# Altium schematic sheet main.SchDoc
size A; SheetNumber: 2; SheetTotal: 2
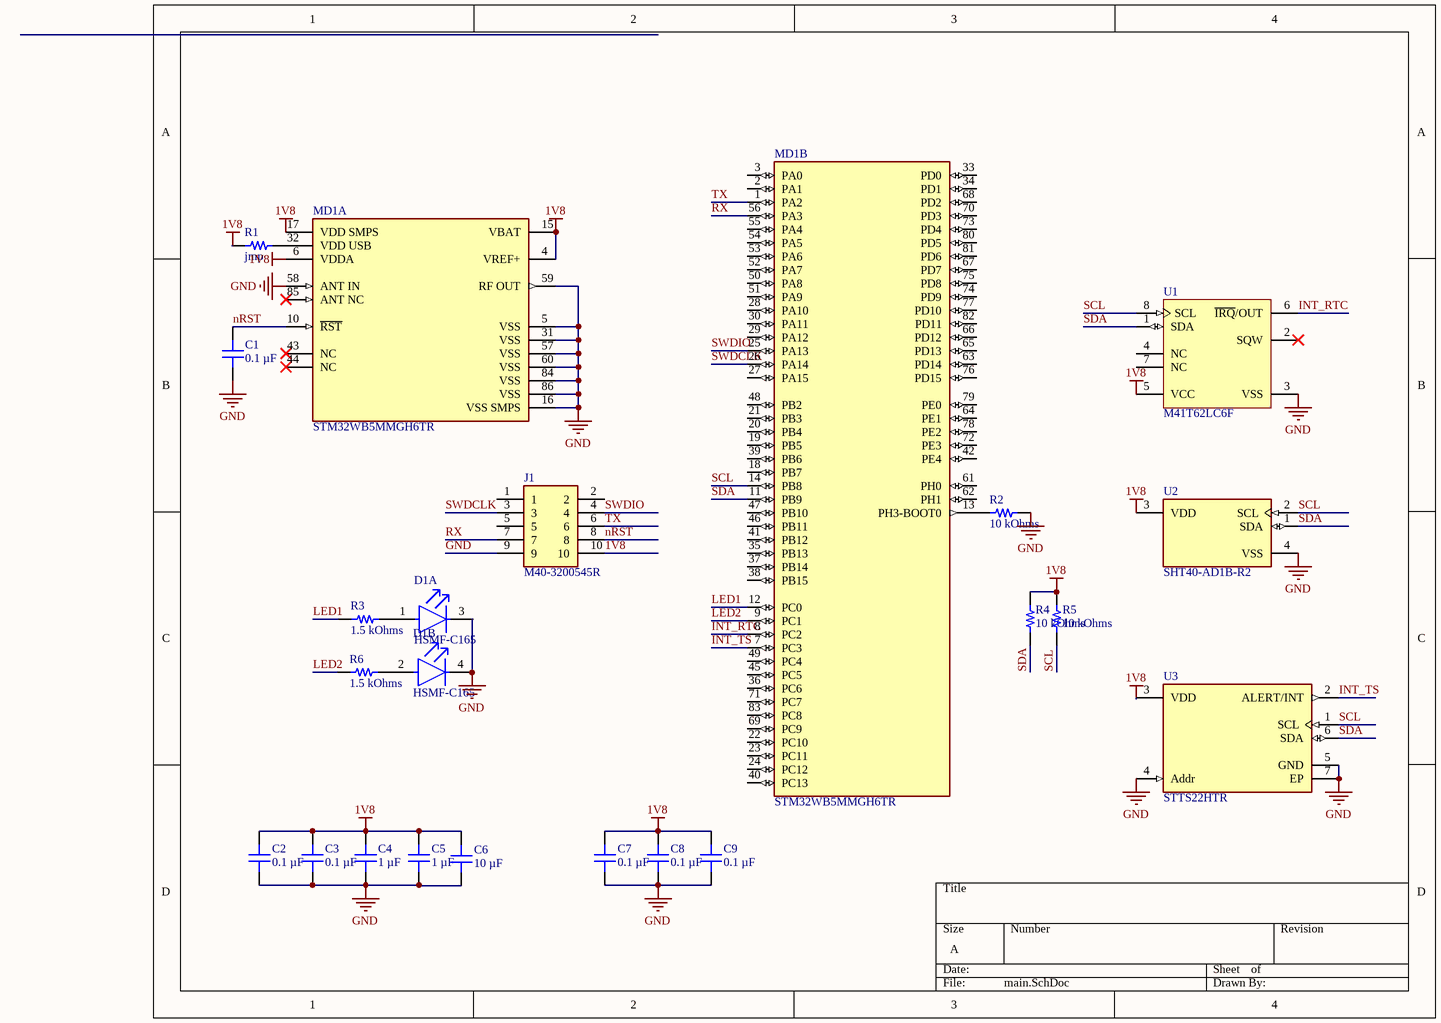
[diagram p0: main.SchDoc]

## Parts
C1  0.1 µF  [CAP 0402_1005]
C2  0.1 µF  [CAP 0402_1005]
C3  0.1 µF  [CAP 0402_1005]
C4  1 µF  [CAP 0402_1005]
C5  1 µF  [CAP 0402_1005]
C6  10 µF  [CAP 0603_1608]
C7  0.1 µF  [CAP 0402_1005]
C8  0.1 µF  [CAP 0402_1005]
C9  0.1 µF  [CAP 0402_1005]
D1  HSMF-C165  [FP-HSMF-C165-MFG]  (parts A,B of 2)
J1  M40-3200545R  [HARWIN_M40-3200545R]
MD1  STM32WB5MMGH6TR  [FP-STM32WB5MMGH6TR-MFG]  (parts A,B of 2)
R1  jmp  [RES 0402_1005]
R2  10 kOhms  [RES 0402_1005]
R3  1.5 kOhms  [RES 0402_1005]
R4  10 kOhms  [RES 0402_1005]
R5  10 kOhms  [RES 0402_1005]
R6  1.5 kOhms  [RES 0402_1005]
U1  M41T62LC6F  [STM-LCC8_V]
U2  SHT40-AD1B-R2  [FP-SHT40-AD1B-R2-MFG]
U3  STTS22HTR  [FP-UDFN-6L-DM00423052-MFG]

## Nets
1V8: C2.2 C3.2 C4.2 C5.2 C6.2 C7.2 C8.2 C9.2 J1.10 MD1.4(VREF+) MD1.6(VDDA) MD1.15(VBAT) MD1.17(VDD_SMPS) R1.1 R4.1 R5.1 U1.5(VCC) U2.3(VDD) U3.3(VDD)
GND: C1.2 C2.1 C3.1 C4.1 C5.1 C6.1 C7.1 C8.1 C9.1 D1.4(RED_C) J1.9 MD1.5(VSS) MD1.16(VSS_SMPS) MD1.31(VSS) MD1.57(VSS) MD1.58(ANT_IN) MD1.59(RF_OUT) MD1.60(VSS) MD1.84(VSS) MD1.86(VSS) R2.1 U1.3(VSS) U2.4(VSS) U3.4(Addr) U3.5(GND) U3.7(EP)
INT_RTC: MD1.8(PC2) U1.6(~{IRQ}/OUT)
INT_TS: MD1.7(PC3) U3.2(ALERT/INT)
LED1: MD1.12(PC0) R3.2
LED2: MD1.9(PC1) R6.2
nRST: C1.1 J1.8 MD1.10(~{RST})
RX: J1.7 MD1.56(PA3)
SCL: MD1.14(PB8) R5.2 U1.8(SCL) U2.2(SCL) U3.1(SCL)
SDA: MD1.11(PB9) R4.2 U1.1(SDA) U2.1(SDA) U3.6(SDA)
SWDCLK: J1.3 MD1.26(PA14)
SWDIO: J1.4 MD1.25(PA13)
TX: J1.6 MD1.1(PA2)
NetD1_1: D1.1(GREEN_A) R3.1
NetD1_2: D1.2(RED_A) R6.1
NetMD1_13: MD1.13(PH3-BOOT0) R2.2
NetMD1_32: MD1.32(VDD_USB) R1.2

Not connected (* = marked no-connect by the designer): D1 3(GREEN_C); J1 1 2 5; MD1 2(PA1) 3(PA0) 18(PB7) 19(PB5) 20(PB4) 21(PB3) 22(PC10) 23(PC11) 24(PC12) 27(PA15) 28(PA10) 29(PA12) 30(PA11) 33(PD0) 34(PD1) 35(PB13) 36(PC6) 37(PB14) 38(PB15) 39(PB6) 40(PC13) 41(PB12) 42(PE4) 43(NC)* 44(NC)* 45(PC5) 46(PB11) 47(PB10) 48(PB2) 49(PC4) 50(PA8) 51(PA9) 52(PA7) 53(PA6) 54(PA5) 55(PA4) 61(PH0) 62(PH1) 63(PD14) 64(PE1) 65(PD13) 66(PD12) 67(PD7) 68(PD2) 69(PC9) 70(PD3) 71(PC7) 72(PE3) 73(PD4) 74(PD9) 75(PD8) 76(PD15) 77(PD10) 78(PE2) 79(PE0) 80(PD5) 81(PD6) 82(PD11) 83(PC8) 85(ANT_NC)*; U1 2(SQW)* 4(NC) 7(NC)

## Library data of the parts
C1 C2 C8 C9 = C0402C104K7PAC7867: CAP CER 0.1UF 4V X5R 0402; manufacturer: KEMET; Tolerance: ±10%; Part Number: C0402C104K7PAC7867; Value: 0.1 µF; Applications: Bypass, Decoupling; Capacitance: 0.1 µF; componentlink1description: Datasheet; componentlink1url: https://api.kemet.com/component-edge/download/datasheet/C0402C104K7PAC7867.pdf; componentlink2description: DigiKey Link; componentlink2url: https://www.digikey.com/en/products/detail/kemet/C0402C104K7PAC7867/7381987; Device Package: 0402 (1005 Metric); lastupdated: 1/9/2022 12:30:40 pm; Lifecycle Status: Active; Minimum Order: 1; Mounting Type: Surface Mount, MLCC; Operating Temperature: -55°C ~ 85°C; Package / Case: 0402 (1005 Metric); packaging: TapeAndReel; partid: 5603; Part Status: Active; price: 0.01; series: SMD Comm X5R; Size / Dimension: 0.039" L x 0.020" W (1.00mm x 0.50mm); Supplier 1: DigiKey; Supplier Part Number 1: 399-14871-1-ND; Temperature Coefficient: X5R; Thickness (Max): 0.022" (0.55mm); Voltage - Rated: 4V
C3 C7 = C0402C104K4RECAUTO: CAP CER 0402 0.1UF 16V X7R 10%; manufacturer: KEMET; Part Number: C0402C104K4RECAUTO; Value: 0.1 µF; Applications: Automotive, ESD Protection; Capacitance: 0.1 µF; componentlink1description: Datasheet; componentlink1url: https://api.kemet.com/component-edge/download/datasheet/C0402C104K4RECAUTO.pdf; componentlink2description: DigiKey Link; componentlink2url: https://www.digikey.com/en/products/detail/kemet/C0402C104K4RECAUTO/8563695; Device Package: 0402 (1005 Metric); lastupdated: 1/9/2022 12:30:53 pm; Lifecycle Status: Active; Minimum Order: 1; Mounting Type: Surface Mount, MLCC; Operating Temperature: -55°C ~ 125°C; Package / Case: 0402 (1005 Metric); packaging: TapeAndReel; partid: 1731; Part Status: Active; price: 0.01; Ratings: AEC-Q200; series: ESD SMD Auto X7R; Size / Dimension: 0.039" L x 0.020" W (1.00mm x 0.50mm); Supplier 1: DigiKey; Supplier Part Number 1: 399-17167-1-ND; Temperature Coefficient: X7R; Thickness (Max): 0.022" (0.55mm); Tolerance: ±10%; Voltage - Rated: 16V
C4 C5 = LMK105BJ105MVHF: CAP CER 1UF 10V X5R 0402; manufacturer: Taiyo Yuden; Tolerance: ±20%; Part Number: LMK105BJ105MVHF; Value: 1 µF; Applications: Automotive, SMPS Filtering; Capacitance: 1 µF; componentlink1description: Datasheet; componentlink1url: https://ds.yuden.co.jp/TYCOMPAS/ut/detail?pn=LMK105BJ105MVHF &u=M; componentlink2description: DigiKey Link; componentlink2url: https://www.digikey.com/en/products/detail/taiyo-yuden/LMK105BJ105MVHF/7403746; Device Package: 0402 (1005 Metric); lastupdated: 1/9/2022 12:30:35 pm; Lifecycle Status: Active; Minimum Order: 1; Mounting Type: Surface Mount, MLCC; Operating Temperature: -55°C ~ 85°C; Package / Case: 0402 (1005 Metric); packaging: TapeAndReel; partid: 46675; Part Status: Active; price: 0.01; Ratings: AEC-Q200; series: M; Size / Dimension: 0.039" L x 0.020" W (1.00mm x 0.50mm); Supplier 1: DigiKey; Supplier Part Number 1: 587-6276-1-ND; Temperature Coefficient: X5R; Thickness (Max): 0.022" (0.55mm); Voltage - Rated: 10V
C6 = GRM188R60J106ME47D: CAP CER 10UF 6.3V X5R 0603; manufacturer: Murata Electronics; Tolerance: ±20%; Part Number: GRM188R60J106ME47D; Value: 10 µF; Applications: General Purpose; Capacitance: 10 µF; componentlink1description: Datasheet; componentlink1url: https://www.murata.com/~/media/webrenewal/support/library/catalog/products/capacitor/mlcc/c02e.ashx?la=en-us; componentlink2description: DigiKey Link; componentlink2url: https://www.digikey.com/en/products/detail/murata-electronics/GRM188R60J106ME47D/965910; Device Package: 0603 (1608 Metric); lastupdated: 11/9/2022 9:40:24 am; Lifecycle Status: Active; Minimum Order: 1; Mounting Type: Surface Mount, MLCC; Operating Temperature: -55°C ~ 85°C; Package / Case: 0603 (1608 Metric); packaging: TapeAndReel; partid: 2351; Part Status: Active; price: 0.02; series: GRM; Size / Dimension: 0.063" L x 0.031" W (1.60mm x 0.80mm); Supplier 1: DigiKey; Supplier Part Number 1: 490-3896-1-ND; Temperature Coefficient: X5R; Thickness (Max): 0.035" (0.90mm); Voltage - Rated: 6.3V
D1 = CMP-2000-06424-2: LED GREEN/RED DIFFUSED 0603 SMD; Reverse Voltage: 5V; Dominant Wavelength: 621nm; Number of Elements: 2; Shape: Rectangular; Luminous Intensity: 10mcd; Forward Current: 20mA; Lens Color: White; Illumination Color: Green; Power Dissipation: 52mW; Wavelength: 572nm; Viewing Angle: 120°; Forward Voltage: 2.2V; Max Operating Temperature: 85°C; Lens Transparency: Diffused; Width: 0.8mm; Case/Package: 0603; Packaging: Tape and Reel; Case Code (Metric): 1608; Depth: 0.8mm; REACH SVHC: No SVHC; Number of LEDs: 2; Radiation Hardening: No; Lens Style: Rectangular; Color: Green; Case Code (Imperial): 0603; Min Operating Temperature: -40°C; Power Rating: 52mW; Number of Pins: 4; Number of Terminals: 4; Package Quantity: 1; Mount: Surface Mount; Height: 0.5mm; Length: 1.6mm; Lead Free: Lead Free; Test Current: 20mA
J1 = M40-3200545R: Connector Header Surface Mount 10 position 0.039 _1.00mm_; MF: Harwin Inc.; Package: None; MP: M40-3200545R; Value: *; Price: None; SnapEDA_Link: https://www.snapeda.com/parts/M40-3200545R/Harwin%20Inc./view-part/494409/?ref=snap; Availability: Unavailable
MD1 = CMP-12160-000017-1: ULTRA-LOW-POWER DUAL CORE ARM CO
R1 = RP73PF1E10KBTD: RES 10K OHM 0.1% 1/10W 0402; Manufacturer: TE Connectivity Passive Product; Power (Watts): 0.1W, 1/10W; Resistance: 10 kOhms; Temperature Coefficient: ±25ppm/°C; Part Number: RP73PF1E10KBTD; Value: jmp; ComponentLink1Description: Datasheet; ComponentLink1URL: https://www.te.com/commerce/DocumentDelivery/DDEController?Action=srchrtrv&DocNm=1773272&DocType=DS&DocLang=English; ComponentLink2Description: DigiKey Link; ComponentLink2URL: https://www.digikey.com/en/products/detail/te-connectivity-passive-product/RP73PF1E10KBTD/8260957; Composition: Thin Film; Device Package: 0402 (1005 Metric); Height - Seated (Max): 0.014" (0.35mm); LastUpdated: 1/9/2022 12:46:57 pm; Lifecycle Status: Active; Minimum Order: 1; Number of Terminations: 2; Operating Temperature: -55°C ~ 155°C; Package / Case: 0402 (1005 Metric); Packaging: TapeAndReel; PartId: 2434; Part Status: Active; Price: 0.09; Series: RP73, Holsworthy; Size / Dimension: 0.039" L x 0.020" W (1.00mm x 0.50mm); Supplier 1: DigiKey; Supplier Part Number 1: A127415CT-ND; Supplier Device Package: 0402; Tolerance: ±0.1%
R2 R4 R5 = RP73PF1E10KBTD: RES 10K OHM 0.1% 1/10W 0402; Manufacturer: TE Connectivity Passive Product; Power (Watts): 0.1W, 1/10W; Temperature Coefficient: ±25ppm/°C; Part Number: RP73PF1E10KBTD; Value: 10 kOhms; ComponentLink1Description: Datasheet; ComponentLink1URL: https://www.te.com/commerce/DocumentDelivery/DDEController?Action=srchrtrv&DocNm=1773272&DocType=DS&DocLang=English; ComponentLink2Description: DigiKey Link; ComponentLink2URL: https://www.digikey.com/en/products/detail/te-connectivity-passive-product/RP73PF1E10KBTD/8260957; Composition: Thin Film; Device Package: 0402 (1005 Metric); Height - Seated (Max): 0.014" (0.35mm); LastUpdated: 1/9/2022 12:46:57 pm; Lifecycle Status: Active; Minimum Order: 1; Number of Terminations: 2; Operating Temperature: -55°C ~ 155°C; Package / Case: 0402 (1005 Metric); Packaging: TapeAndReel; PartId: 2434; Part Status: Active; Price: 0.09; Resistance: 10 kOhms; Series: RP73, Holsworthy; Size / Dimension: 0.039" L x 0.020" W (1.00mm x 0.50mm); Supplier 1: DigiKey; Supplier Part Number 1: A127415CT-ND; Supplier Device Package: 0402; Tolerance: ±0.1%
R3 R6 = ERA-2VRW1501X: RES 1.5K OHM 0.05% 1/10W 0402; Manufacturer: Panasonic Electronic Components; Power (Watts): 0.1W, 1/10W; Temperature Coefficient: ±10ppm/°C; Part Number: ERA-2VRW1501X; Value: 1.5 kOhms; ComponentLink1Description: Datasheet; ComponentLink1URL: https://api.pim.na.industrial.panasonic.com/file_stream/main/fileversion/9152; ComponentLink2Description: DigiKey Link; ComponentLink2URL: https://www.digikey.com/en/products/detail/panasonic-electronic-components/ERA-2VRW1501X/12086957; Composition: Thin Film; Device Package: 0402 (1005 Metric); Features: Anti-Sulfur, Automotive AEC-Q200; Height - Seated (Max): 0.016" (0.40mm); LastUpdated: 11/9/2022 9:53:08 am; Lifecycle Status: Active; Minimum Order: 1; Number of Terminations: 2; Operating Temperature: -55°C ~ 155°C; Package / Case: 0402 (1005 Metric); Packaging: TapeAndReel; PartId: 67400; Part Status: Active; Price: 0.24; Ratings: AEC-Q200; Resistance: 1.5 kOhms; Series: ERA-2V; Size / Dimension: 0.039" L x 0.020" W (1.00mm x 0.50mm); Supplier 1: DigiKey; Supplier Part Number 1: 10-ERA-2VRW1501XCT-ND; Supplier Device Package: 0402; Tolerance: ±0.05%
U1 = CMP-2000-06643-1: Low-Power Serial Real-Time Clock (RTC) with Alarm, 400 KHz, 1.3 to 4.4 V, -40 to 85 degC, 8-Pin LCC, RoHS, Tape and Reel; Manufacturer: STMicroelectronics; Interface: I²C,2-WireSerial; Current - Timekeeping (Max): 0.7µA~0.95µA@1.3V~4.4V; Other Related Documents: M41T62ViewAllSpecifications; Date Format: YY-MM-DD-dd; Voltage - Supply: 1.3V~4.4V; Online Catalog: SerialAddress; For Use With: 497-16464-ND / -EVALBOARDFORM41T62; Time Format: HH:MM:SS:hh(24hr); Other Names: 497-11275-1; Product Training Modules: SmartGridSolutions:SmartGridDistribution/SmartMeters; Standard Package: 1; Mounting Technology: SurfaceMount; Operating Temperature: -40°C~85°C; Features: Alarm,LeapYear,SquareWaveOutput,WatchdogTimer; Packaging: CutTape(CT); Family: Clock/Timing-RealTimeClocks; Package Description: 8-Pin Leadless Ceramic Chip Carrier, Body 3.2 x 1.5 mm, Pitch 0.9 mm; Mounting Type: SurfaceMount; Series: Timekeeper®; Manufacturer URL: http://www.st.com/; Datasheet URL: http://www.st.com/web/en/resource/technical/document/datasheet/CD00019860.pdf; Package Reference: LCC8; Package / Case: 8-LCC; Type: Clock/Calendar; Category: IntegratedCircuits(ICs); Datasheet Version: Rev. 22, 10/2015; Supplier Device Package: 8-LCC(1.5x3.2)
U2 = CMP-144040-000008-1: SENSOR HUMIDITY 100 RH SMD
U3 = CMP-12184-000002-1: LOW-VOLTAGE, ULTRA-LOW-POWER, 0.; Manufacturer: STMicroelectronics; Max Supply Voltage: 3.6V; Sensor Output: I2C,SMBus; Min Supply Voltage: 1.5V; Resolution: 16bits; Standoff Height: 0mm; Operating Supply Current: 1.75-120uA; Octopart: https://octopart.com/stts22htr-stmicroelectronics-103417944; Temperature: -40°C to +125°C; Interface: I2C,SMBus; ComponentLink2Description: Datasheet; Device Class L3: unset; Lead Free: Yes; Temperature Range Low: -40°C; ComponentLink2URL: https://www.st.com/resource/en/datasheet/stts22h.pdf; Temperature Range High: +125°C; RoHS: TRUE; Automotive: No; Device Class L1: Sensors; Category: IC; Manufacturer Part Number: STTS22HTR; Package: UDFN-6L-DM00423052; Device Class L2: Temperature and Humidity Sensors; Mouser Description: Low-voltage, ultra-low-power, 0.5 ï¿½C accuracy Iï¿½C/SMBus 3.0 temperature sensor; Digikey Description: LOW-VOLTAGE, ULTRA-LOW-POWER, 0.; Height: 0.55mm